# EAGLE schematic axoloti_micro_modular_002 (EAGLE 7.3.0)
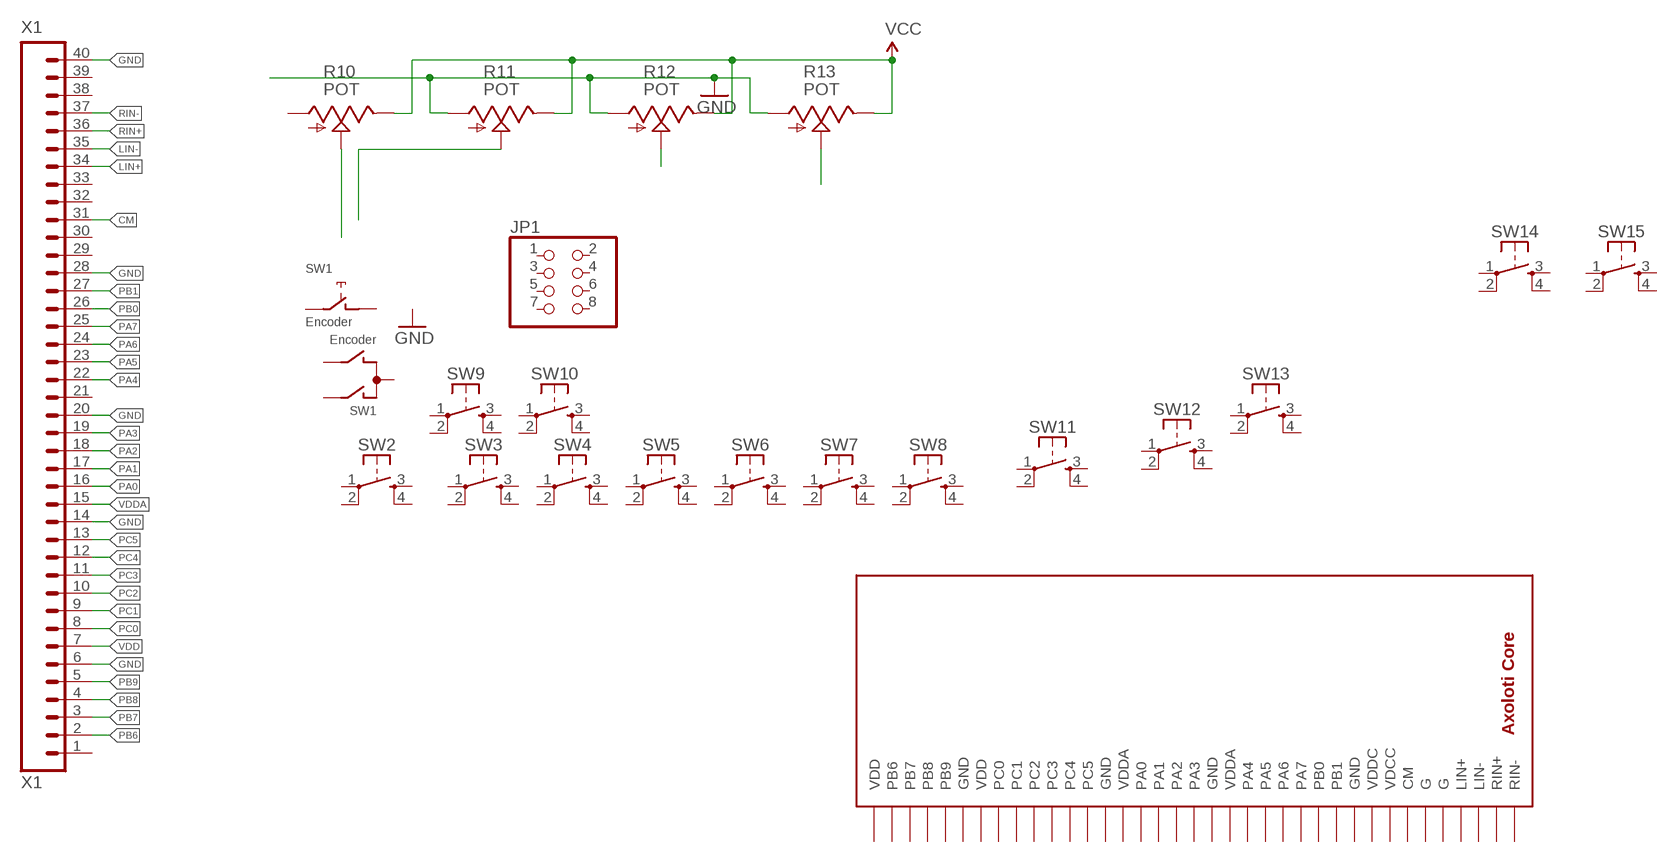
[diagram p0: schematic, sheet 1]

## Parts
JP1  PINHD-2X4  [2X04]
R10  POT  POT_US  [ALPS_POT_SFE]
R11  POT  POT_US  [ALPS_POT_SFE]
R12  POT  POT_US  [ALPS_POT_SFE]
R13  POT  POT_US  [ALPS_POT_SFE]
SW1  Encoder  EC12E_SW  [ALPS_EC12E_SW]
SW2  SW-TACTILE-6X6  [SW6X6]
SW3  SW-TACTILE-6X6  [SW6X6]
SW4  SW-TACTILE-6X6  [SW6X6]
SW5  SW-TACTILE-6X6  [SW6X6]
SW6  SW-TACTILE-6X6  [SW6X6]
SW7  SW-TACTILE-6X6  [SW6X6]
SW8  SW-TACTILE-6X6  [SW6X6]
SW9  SW-TACTILE-6X6  [SW6X6]
SW10  SW-TACTILE-6X6  [SW6X6]
SW11  SW-TACTILE-6X6  [SW6X6]
SW12  SW-TACTILE-6X6  [SW6X6]
SW13  SW-TACTILE-6X6  [SW6X6]
SW14  SW-TACTILE-6X6  [SW6X6]
SW15  SW-TACTILE-6X6  [SW6X6]
U$1  AXOLOTI_SHIELD_CUTOUT  [AXOLOTI_SHIELD_CUTOUT]
X1  X1  M40  [1X40]

## Nets
CM: X1.31
GND: R11.P$3(A) R12.P$3(A) R13.P$3(A) X1.6 X1.14 X1.20 X1.28 X1.40
LIN+: X1.34
LIN-: X1.35
N$14: R10.P$2(S)
N$15: R11.P$2(S)
N$16: R12.P$2(S)
N$17: R13.P$2(S)
PA0: X1.16
PA1: X1.17
PA2: X1.18
PA3: X1.19
PA4: X1.22
PA5: X1.23
PA6: X1.24
PA7: X1.25
PB0: X1.26
PB1: X1.27
PB6: X1.2
PB7: X1.3
PB8: X1.4
PB9: X1.5
PC0: X1.8
PC1: X1.9
PC2: X1.10
PC3: X1.11
PC4: X1.12
PC5: X1.13
RIN+: X1.36
RIN-: X1.37
VCC: R10.P$1(E) R11.P$1(E) R12.P$1(E) R13.P$1(E)
VDD: X1.7
VDDA: X1.15
Unconnected: JP1.1 JP1.2 JP1.3 JP1.4 JP1.5 JP1.6 JP1.7 JP1.8 R10.P$3(A) SW1.A SW1.B SW1.C SW1.D SW1.E SW1.GND1(G) SW1.GND2(G) SW2.1 SW2.2 SW2.3(S1) SW2.4(S2) SW3.1 SW3.2 SW3.3(S1) SW3.4(S2) SW4.1 SW4.2 SW4.3(S1) SW4.4(S2) SW5.1 SW5.2 SW5.3(S1) SW5.4(S2) SW6.1 SW6.2 SW6.3(S1) SW6.4(S2) SW7.1 SW7.2 SW7.3(S1) SW7.4(S2) SW8.1 SW8.2 SW8.3(S1) SW8.4(S2) SW9.1 SW9.2 SW9.3(S1) SW9.4(S2) SW10.1 SW10.2 SW10.3(S1) SW10.4(S2) SW11.1 SW11.2 SW11.3(S1) SW11.4(S2) SW12.1 SW12.2 SW12.3(S1) SW12.4(S2) SW13.1 SW13.2 SW13.3(S1) SW13.4(S2) SW14.1 SW14.2 SW14.3(S1) SW14.4(S2) SW15.1 SW15.2 SW15.3(S1) SW15.4(S2) U$1.CM U$1.G1(G) U$1.G2(G) U$1.GND1(GND) U$1.GND2(GND) U$1.GND3(GND) U$1.GND4(GND) U$1.LIN+ U$1.LIN- U$1.PA0 U$1.PA1 U$1.PA2 U$1.PA3 U$1.PA4 U$1.PA5 U$1.PA6 U$1.PA7 U$1.PB0 U$1.PB1 U$1.PB6 U$1.PB7 U$1.PB8 U$1.PB9 U$1.PC0 U$1.PC1 U$1.PC2 U$1.PC3 U$1.PC4 U$1.PC5 U$1.RIN+ U$1.RIN- U$1.VDD@1(VDD) U$1.VDD@2(VDD) U$1.VDDA1(VDDA) U$1.VDDA2(VDDA) U$1.VDDC1(VDDC) U$1.VDDC2(VDCC) X1.1 X1.21 X1.29 X1.30 X1.32 X1.33 X1.38 X1.39

## Library data of the parts
JP1 = adafruit:PINHD-2X4: PIN HEADER
R10-R13 = pot-alps:POT_US
SW1 = switch-alps:EC12E_SW: ALPS rotary Encoder EC12E series with switch
SW2-SW15 = we-switch:SW-TACTILE: Tactile Switches
U$1 = axoloti:AXOLOTI_SHIELD_CUTOUT
X1 = SparkFun-Connectors:M40: 1x40 .1" header

## Net classes
0 default: width 0.305 mm